# EAGLE design BPW5015-16bitBuffer (EAGLE 6.3)
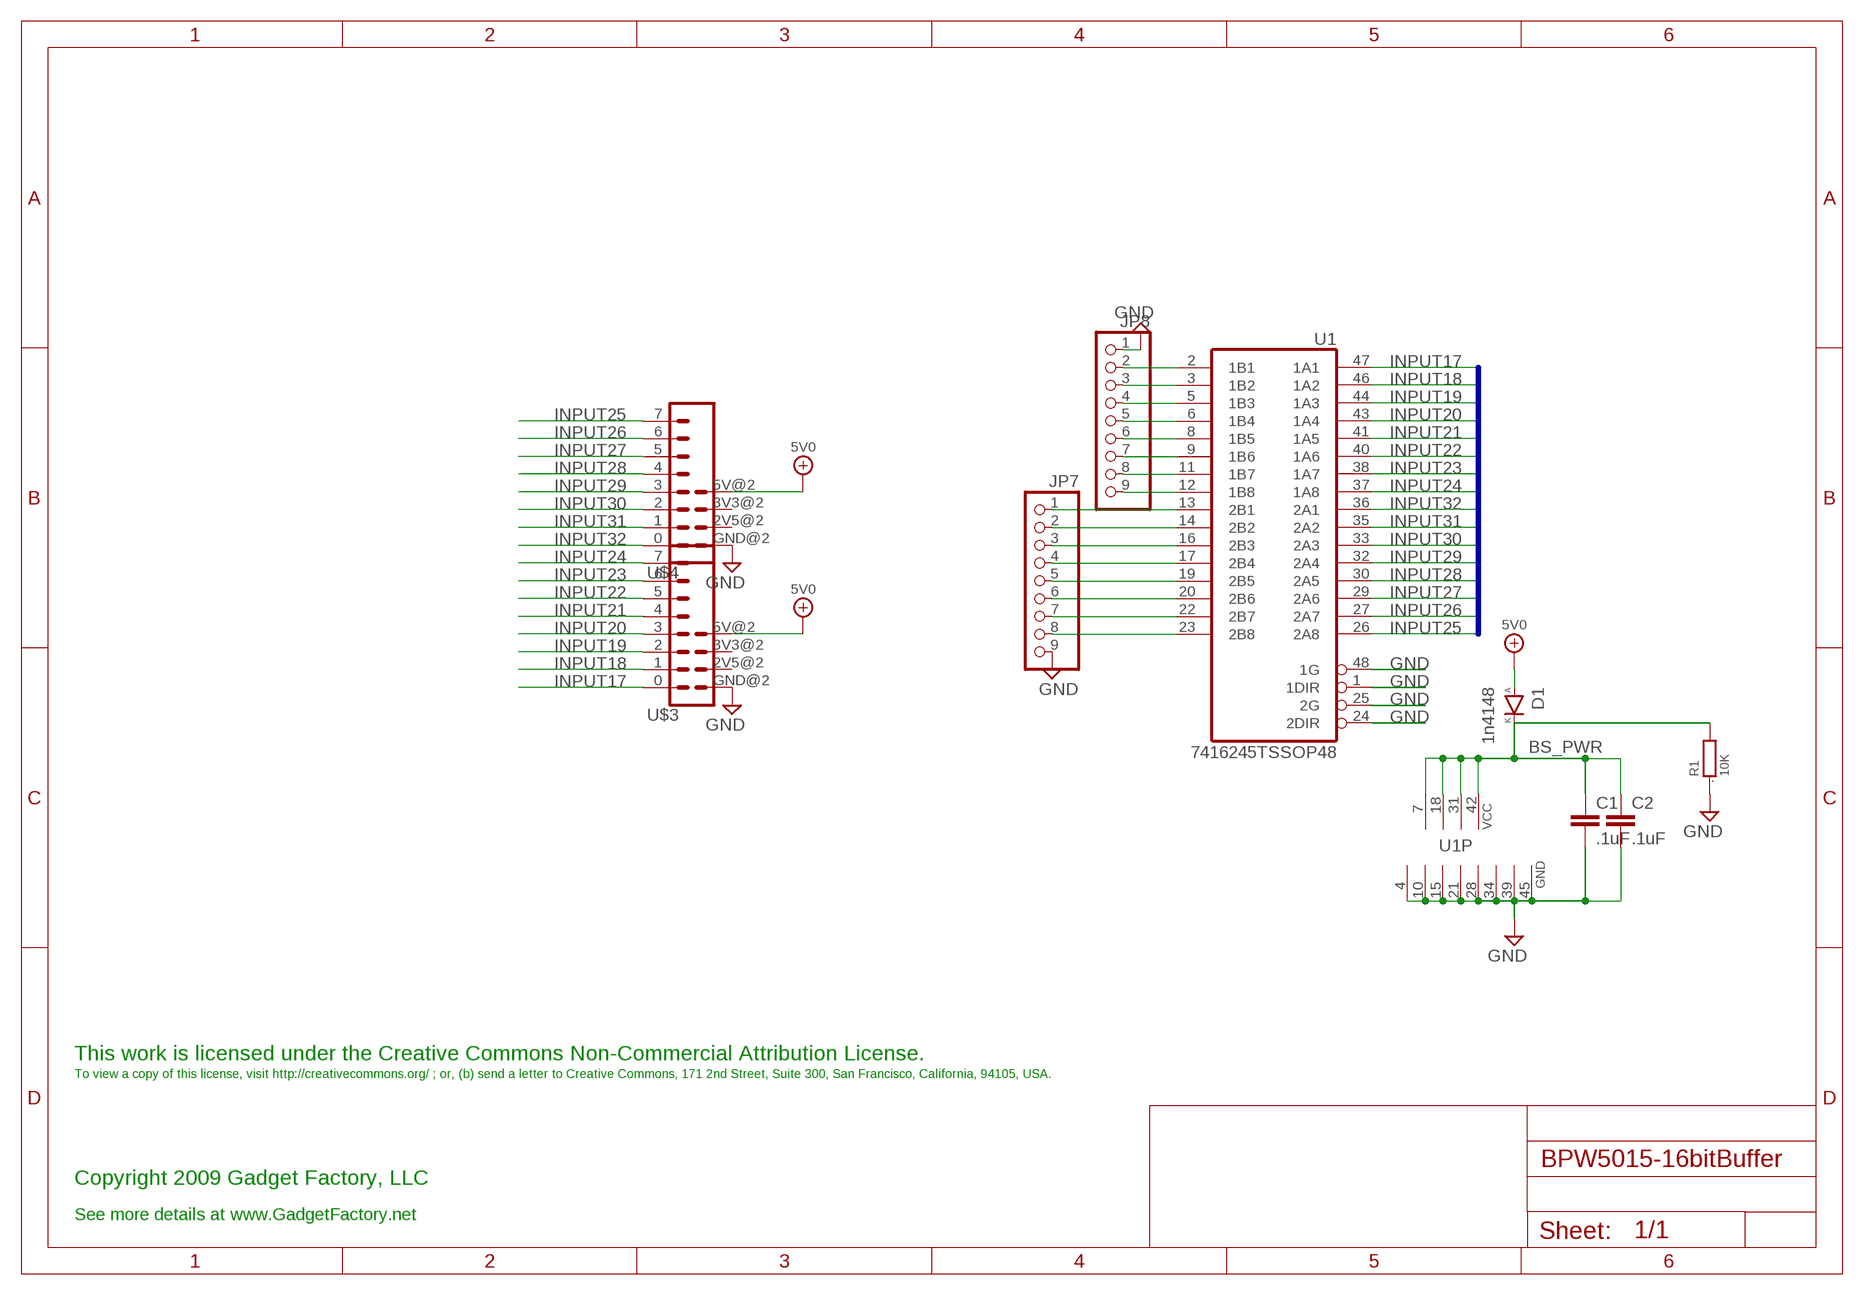
[diagram p0: schematic, sheet 1]

## Parts
C1  .1uF  C-EUC0603  [C0603]
C2  .1uF  C-EUC0603  [C0603]
D1  1n4148  DIODE_SOD323  [SOD323]
JP7  PINHD-1X9  [1X09]
JP8  PINHD-1X9  [1X09]
R1  10K  R0603  [0603]
U1  7416245TSSOP48  [TSSOP48]
U$3  WING8  [WINGSIDE_8BIT]
U$4  WING8  [WINGSIDE_8BIT]

## Nets
5V0: D1.A U$3.5V@2(5V) U$4.5V@2(5V)
BS_PWR: C1.1 C2.1 D1.K R1.2 U1.7(VCC) U1.18(VCC) U1.31(VCC) U1.42(VCC)
GND: C1.2 C2.2 JP7.9 JP8.1 R1.1 U1.1(1DIR) U1.4(GND) U1.10(GND) U1.15(GND) U1.21(GND) U1.24(2DIR) U1.25(2G) U1.28(GND) U1.34(GND) U1.39(GND) U1.45(GND) U1.48(1G) U$3.GND@2(GND) U$4.GND@2(GND)
INPUT17: U1.47(1A1) U$3.0
INPUT18: U1.46(1A2) U$3.1
INPUT19: U1.44(1A3) U$3.2
INPUT20: U1.43(1A4) U$3.3
INPUT21: U1.41(1A5) U$3.4
INPUT22: U1.40(1A6) U$3.5
INPUT23: U1.38(1A7) U$3.6
INPUT24: U1.37(1A8) U$3.7
INPUT25: U1.26(2A8) U$4.7
INPUT26: U1.27(2A7) U$4.6
INPUT27: U1.29(2A6) U$4.5
INPUT28: U1.30(2A5) U$4.4
INPUT29: U1.32(2A4) U$4.3
INPUT30: U1.33(2A3) U$4.2
INPUT31: U1.35(2A2) U$4.1
INPUT32: U1.36(2A1) U$4.0
N$11: JP8.9 U1.12(1B8)
N$12: JP8.8 U1.11(1B7)
N$13: JP8.7 U1.9(1B6)
N$14: JP8.6 U1.8(1B5)
N$15: JP8.5 U1.6(1B4)
N$16: JP8.4 U1.5(1B3)
N$17: JP8.3 U1.3(1B2)
N$18: JP8.2 U1.2(1B1)
N$19: JP7.1 U1.13(2B1)
N$20: JP7.2 U1.14(2B2)
N$22: JP7.3 U1.16(2B3)
N$23: JP7.4 U1.17(2B4)
N$24: JP7.5 U1.19(2B5)
N$25: JP7.6 U1.20(2B6)
N$26: JP7.7 U1.22(2B7)
N$27: JP7.8 U1.23(2B8)
Unconnected: U$3.2V5@2(2V5) U$3.3V3@2(3V3) U$4.2V5@2(2V5) U$4.3V3@2(3V3)

## Buses
INPUT[17..32]

## Notes on the sheet
- This work is licensed under the Creative Commons Non-Commercial Attribution License.
- To view a copy of this license, visit http://creativecommons.org/ ; or, (b) send a letter to Creative Commons, 171 2nd Street, Suite 300, San Francisco, California, 94105, USA.
- Copyright 2009 Gadget Factory, LLC
- See more details at www.GadgetFactory.net

## Library data of the parts
C1 C2 = rcl:C-EU: CAPACITOR, European symbol
D1 = GadgetFactory:DIODE
JP7 JP8 = pinhead-2:PINHD-1X9: PIN HEADER
R1 = GadgetFactory:R: RESISTOR, European symbol
U1 = GadgetFactory:74*16245: 16-bit BUS TRANSCEIVER, 3-state
U$3 U$4 = Papilio:WING8

## Board
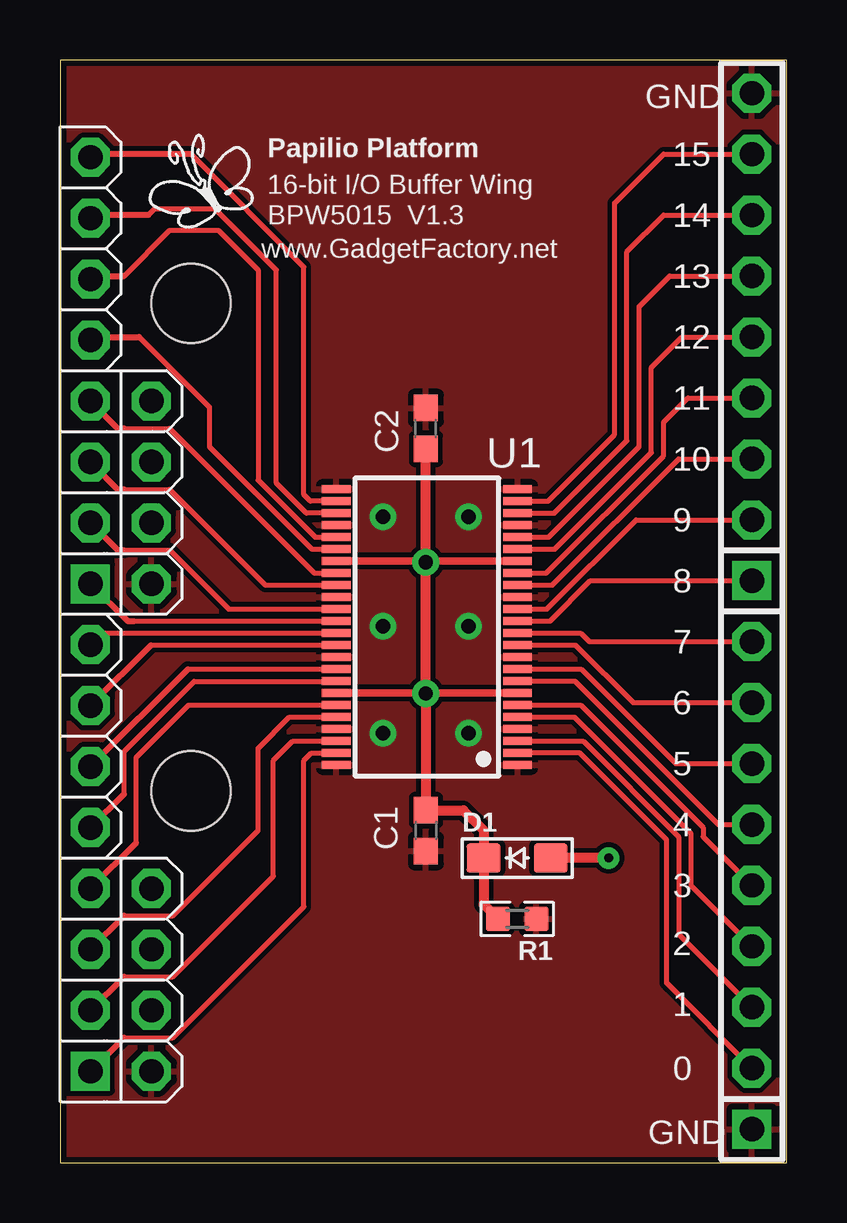
[diagram p1: board, top side]
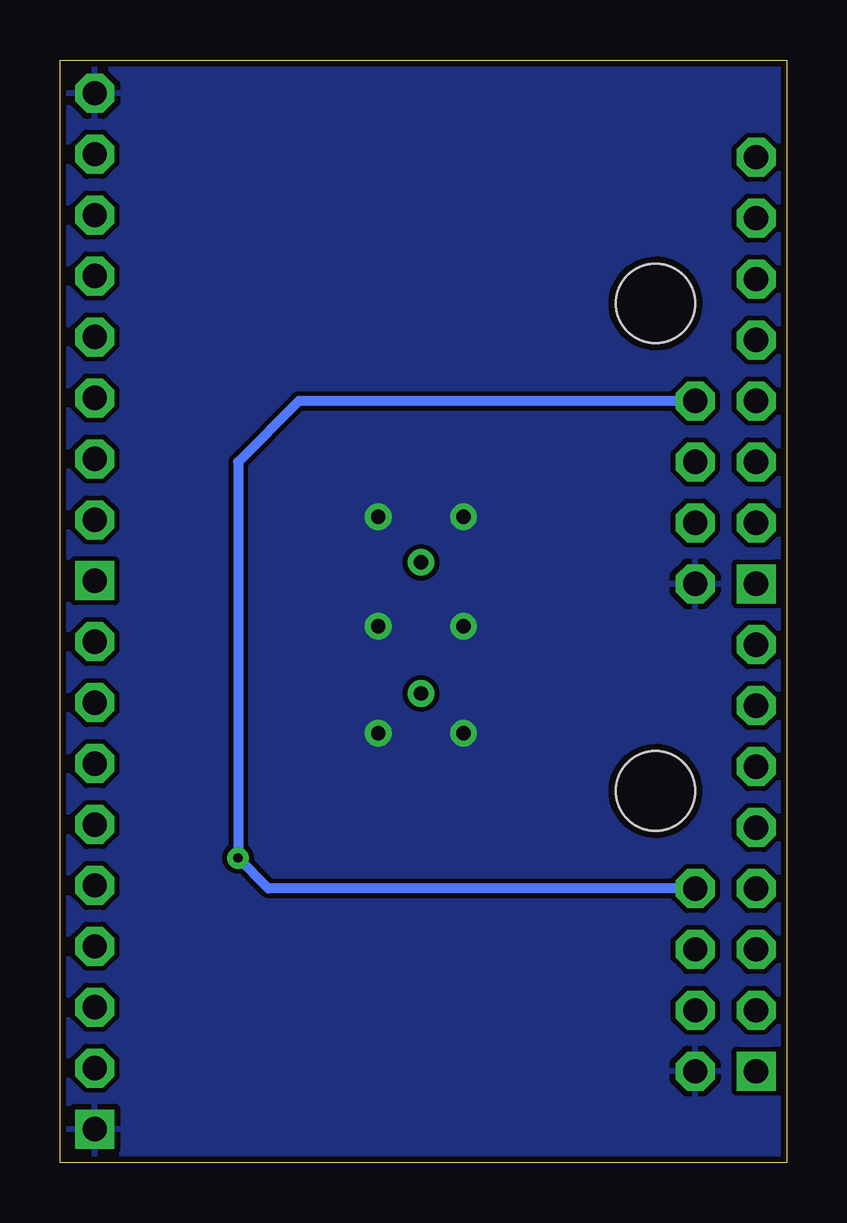
[diagram p2: board, bottom side, seen from below]

Size 30.28 x 45.96 mm. Coordinates in mm from the lower left corner, seen from the top.
Outline: 0,0 30.28,0 30.28,45.96 0,45.96 0,0
Copper layers (1*16): Top 0.035mm / dielectric 1.5mm / Bottom 0.035mm
Design rules "SparkFun_Derived_GoldePheonix_7mil": minimum track width 7mil, minimum drill 15mil, track to track 8mil, track to pad 8mil, pad to pad 8mil, via to via 8mil, smd to smd 8mil, copper to edge 10mil, drill to drill 8mil, minimum pad ring 12mil, minimum via ring 10mil, stop-mask expansion 4mil, vias tented up to drill 18mil, thermal gap 10mil

### Footprints (pad centres in the part's own frame; a part is rotated, then mirrored left to right if it is on the bottom)
C0603 = smd 1.1 x 1: 1 -0.85,0; 2 0.85,0
SOD323 = smd 1.4 x 1.2: A 1.4,0; K -1.4,0
1X09 = drill 1.016 square: 1 -10.16,0 | drill 1.016 octagon: 2 -7.62,0; 3 -5.08,0; 4 -2.54,0; 5 0,0; 6 2.54,0; 7 5.08,0; 8 7.62,0; 9 10.16,0
0603 = smd 1 x 1: 1 -0.8,0; 2 0.8,0
TSSOP48 = smd 0.32 x 1.2: 1 0.702,-0.778; 2 1.202,-0.778; 3 1.702,-0.778; 4 2.202,-0.778; 5 2.702,-0.778; 6 3.202,-0.778; 7 3.702,-0.778; 8 4.202,-0.778; 9 4.702,-0.778; 10 5.202,-0.778; 11 5.702,-0.778; 12 6.202,-0.778; 13 6.702,-0.778; 14 7.202,-0.778; 15 7.702,-0.778; 16 8.202,-0.778; 17 8.702,-0.778; 18 9.202,-0.778; 19 9.702,-0.778; 20 10.202,-0.778; 21 10.702,-0.778; 22 11.202,-0.778; 23 11.702,-0.778; 24 12.202,-0.778; 25 12.202,6.772; 26 11.702,6.772; 27 11.202,6.772; 28 10.702,6.772; 29 10.202,6.772; 30 9.702,6.772; 31 9.202,6.772; 32 8.702,6.772; 33 8.202,6.772; 34 7.702,6.772; 35 7.202,6.772; 36 6.702,6.772; 37 6.202,6.772; 38 5.702,6.772; 39 5.202,6.772; 40 4.702,6.772; 41 4.202,6.772; 42 3.702,6.772; 43 3.202,6.772; 44 2.702,6.772; 45 2.202,6.772; 46 1.702,6.772; 47 1.202,6.772; 48 0.702,6.772
WINGSIDE_8BIT = drill 1.016 square: 0 19.05,1.27 | drill 1.016 octagon: 1 16.51,1.27; 2 13.97,1.27; 2V5@2 16.51,3.81; 3 11.43,1.27; 3V3@2 13.97,3.81; 4 8.89,1.27; 5 6.35,1.27; 5V@2 11.43,3.81; 6 3.81,1.27; 7 1.27,1.27; GND@2 19.05,3.81 | hole 3.302: 7.366,5.461

### Placement (x,y rotation side)
C1  15.24,13.84 270 top
C2  15.24,30.61 90 top
D1  19.05,12.7 0 top
JP7  28.83,34.42 90 top
JP8  28.83,11.56 90 top
R1  19.05,10.16 180 top
U1  18.29,15.88 90 top
U$1  [BUTTERFLY_LOGO]  5.97,40.39 0 top
U$3  0,22.86 270 top
U$4  0,43.18 270 top

### Tracks (layer width: path | path; a pad name or v marks a point on that pad's centre or on a via)
5V0  (via drill 0.38)
  Top 0.406: v22.86,12.7 D1.A
  Bottom 0.406: U$3.5V@2 21.59,11.43 v22.86,12.7 22.86,29.21 20.32,31.75 U$4.5V@2
BS_PWR  (via drill 0.6)
  Top 0.305: U1.31 15.17,25.08 15.24,25.15 | U1.18 15.3,25.08 v15.24,25.02 | U1.42 15.09,19.58 15.24,19.43 | U1.7 15.26,19.58 v15.24,19.56
  Top 0.406: C2.1 15.24,25.15 v15.24,25.02 v15.24,19.56 15.24,19.43 C1.1 16.8,14.69 17.65,13.84 D1.K 17.65,10.76 R1.2
GND  (via drill 0.6)
  other vias: 13.46,22.35 13.46,26.92 17.02,26.92 17.02,22.35 17.02,17.91 13.46,17.91
  pour Top: 0.13,45.85 30.1,45.85 30.1,0.13 0.13,0.13
  pour Bottom: 0.13,45.85 30.1,45.85 30.1,0.13 0.13,0.13
INPUT17
  Top 0.203: 2.67,5.21 4.7,5.21 10.16,10.67 10.16,16.76 10.47,17.08 U1.47
  Top 0.254: U$3.0 2.67,5.21
INPUT18
  Top 0.203: 2.67,7.75 4.7,7.75 8.89,11.94 8.89,16.76 9.7,17.58 U1.46
  Top 0.254: U$3.1 2.67,7.75
INPUT19
  Top 0.203: 2.67,10.29 4.7,10.29 8.26,13.84 8.26,17.27 9.56,18.58 U1.44
  Top 0.254: U$3.2 2.67,10.29
INPUT20
  Top 0.203: U1.43 5.36,19.08 3.17,16.89 3.17,13.34
  Top 0.254: U$3.3 3.17,13.34
INPUT21
  Top 0.203: 10.93,20.08 U1.41 11.51,20.07 5.59,20.07 2.67,17.14 2.67,15.37
  Top 0.254: U$3.4 2.67,15.37
INPUT22
  Top 0.203: 5.34,20.58 U1.40
  Top 0.254: U$3.5 5.34,20.58
INPUT23
  Top 0.203: 3.8,21.58 U1.38
  Top 0.254: U$3.6 3.8,21.58
INPUT24
  Top 0.203: 1.76,22.08 U1.37
  Top 0.254: U$3.7 1.76,22.08
INPUT25
  Top 0.203: U1.26 10.43,27.58 10.16,27.85 10.16,37.34 5.46,42.04
  Top 0.254: 5.46,42.04 1.4,42.04 U$4.7
INPUT26
  Top 0.203: U1.27 10.26,27.08 9.02,28.32 9.02,37.21 6.48,39.75 3.94,39.75 3.68,39.5
  Top 0.254: 3.68,39.5 1.4,39.5 U$4.6
INPUT27
  Top 0.203: U1.29 10.63,26.08 8.26,28.45 8.26,37.21 6.6,38.86 4.57,38.86 2.67,36.96
  Top 0.254: 2.67,36.96 1.4,36.96 U$4.5
INPUT28
  Top 0.203: U1.30 10.49,25.58 6.22,29.84 6.22,31.5 3.3,34.42
  Top 0.254: 3.3,34.42 1.4,34.42 U$4.4
INPUT29
  Top 0.203: U1.32 10.6,24.58 4.57,30.61 2.67,30.61
  Top 0.254: 2.67,30.61 2.41,30.61 U$4.3
INPUT30
  Top 0.203: U1.33 8.56,24.08 4.57,28.07 2.67,28.07
  Top 0.254: 2.67,28.07 2.41,28.07 U$4.2
INPUT31
  Top 0.203: U1.35 7.02,23.08 4.57,25.53 2.67,25.53
  Top 0.254: 2.67,25.53 2.41,25.53 U$4.1
INPUT32
  Top 0.203: 3.08,22.58 U1.36
  Top 0.254: 3.08,22.58 2.82,22.58 U$4.0
N$11
  Top 0.203: U1.12 21.7,22.08 22.05,21.72 JP8.9
N$12
  Top 0.203: U1.11 21.48,21.58 23.88,19.18 JP8.8
N$13
  Top 0.203: JP8.7 25.65,16.64 21.71,20.58 U1.9
N$14
  Top 0.203: JP8.6 27.43,14.1 21.45,20.08 U1.8
N$15
  Top 0.203: U1.6 21.69,19.08 26.8,13.97 26.8,13.59 JP8.5
N$16
  Top 0.203: U1.5 21.43,18.58 26.29,13.72 26.29,11.56 JP8.4
N$17
  Top 0.203: U1.3 21.79,17.58 25.78,13.59 25.78,9.53 JP8.3
N$18
  Top 0.203: U1.2 21.66,17.08 25.27,13.46 25.27,7.49 JP8.2
N$19
  Top 0.203: JP7.1 22.1,24.26 20.42,22.58 U1.13
N$20
  Top 0.203: JP7.2 24,26.8 20.28,23.08 U1.14
N$22
  Top 0.203: JP7.3 25.78,29.34 20.52,24.08 U1.16
N$23
  Top 0.203: JP7.4 26.16,31.88 25.15,30.86 25.15,29.46 20.26,24.58 U1.17
N$24
  Top 0.203: JP7.5 25.91,34.42 24.64,33.15 24.64,29.59 20.62,25.58 U1.19
N$25
  Top 0.203: JP7.6 25.4,36.96 24.13,35.69 24.13,29.84 20.36,26.08 U1.20
N$26
  Top 0.203: U1.22 20.6,27.08 23.62,30.1 23.62,37.97 25.15,39.5 JP7.7
N$27
  Top 0.203: JP7.8 25.15,42.04 23.11,40.01 23.11,30.35 20.34,27.58 U1.23

### Text on the board
tPlace: GND | Papilio Platform | 15 | 16-bit I/O Buffer Wing | BPW5015 V1.3 | 14 | www.GadgetFactory.net | 13 | 12 | 11 | 10 | 9 | 8 | 7 | 6 | 5 | 4 | 3 | 2 | 1 | 0 | GND